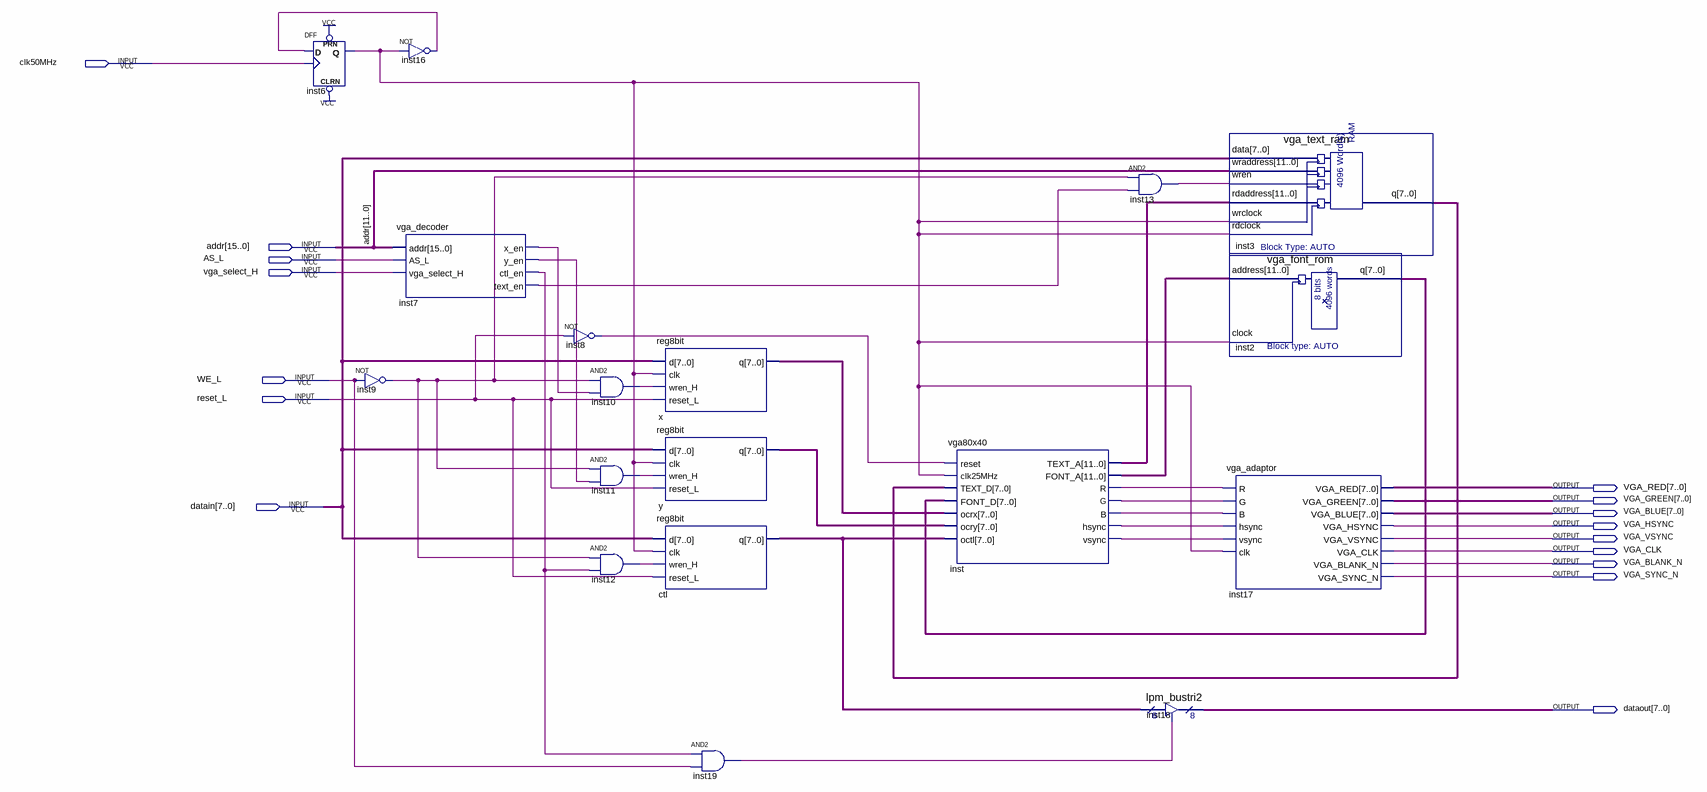
[diagram p0: schematic sheet]
// Quartus schematic vga.bdf as structural Verilog: 18 symbols, 16 pins
module vga (
  input  clk50MHz,
  input  [15:0] addr,
  input  AS_L,
  input  vga_select_H,
  input  WE_L,
  input  reset_L,
  input  [7:0] datain,
  output [7:0] VGA_RED,
  output [7:0] VGA_GREEN,
  output [7:0] VGA_BLUE,
  output VGA_HSYNC,
  output VGA_VSYNC,
  output VGA_CLK,
  output VGA_BLANK_N,
  output VGA_SYNC_N,
  output [7:0] dataout
);

  wire inst6_q, inst7_ctl_en, inst7_text_en, inst7_x_en, inst7_y_en, inst8_out, inst9_out, inst10_out,
       inst11_out, inst12_out, inst13_out, inst16_out, inst19_out, inst_b, inst_g, inst_hsync, inst_r,
       inst_vsync;
  wire [7:0] ctl_q, inst2_q, inst3_q, x_q, y_q;
  wire [11:0] inst_font_a, inst_text_a;

  DFF inst6 (.CLRN(1'b1), .CLK(clk50MHz), .D(inst16_out), .PRN(1'b1), .Q(inst6_q));
  not inst9 (inst9_out, WE_L);
  not inst16 (inst16_out, inst6_q);
  vga_decoder inst7 (
    .addr(addr), .AS_L(AS_L), .vga_select_H(vga_select_H), .x_en(inst7_x_en), .y_en(inst7_y_en),
    .ctl_en(inst7_ctl_en), .text_en(inst7_text_en));
  not inst8 (inst8_out, reset_L);
  and inst10 (inst10_out, inst9_out, inst7_x_en);
  and inst11 (inst11_out, inst9_out, inst7_y_en);
  and inst12 (inst12_out, inst9_out, inst7_ctl_en);
  reg8bit x (.d(datain), .clk(inst6_q), .wren_H(inst10_out), .reset_L(reset_L), .q(x_q));
  reg8bit y (.d(datain), .clk(inst6_q), .wren_H(inst11_out), .reset_L(reset_L), .q(y_q));
  reg8bit ctl (.d(datain), .clk(inst6_q), .wren_H(inst12_out), .reset_L(reset_L), .q(ctl_q));
  and inst19 (inst19_out, inst7_ctl_en, WE_L);
  vga80x40 inst (
    .reset(inst8_out), .clk25MHz(inst6_q), .TEXT_D(inst3_q), .FONT_D(inst2_q), .ocrx(x_q), .ocry(y_q),
    .octl(ctl_q), .TEXT_A(inst_text_a), .FONT_A(inst_font_a), .R(inst_r), .G(inst_g), .B(inst_b),
    .hsync(inst_hsync), .vsync(inst_vsync));
  and inst13 (inst13_out, inst9_out, inst7_text_en);
  lpm_bustri2 inst18 (.enabledt(inst19_out), .data(ctl_q), .tridata(dataout));
  vga_text_ram inst3 (
    .data(datain), .wraddress(addr[11:0]), .wren(inst13_out), .rdaddress(inst_text_a), .wrclock(inst6_q),
    .rdclock(inst6_q), .q(inst3_q));
  vga_font_rom inst2 (.address(inst_font_a), .clock(inst6_q), .q(inst2_q));
  vga_adaptor inst17 (
    .R(inst_r), .G(inst_g), .B(inst_b), .hsync(inst_hsync), .vsync(inst_vsync), .clk(inst6_q),
    .VGA_RED(VGA_RED), .VGA_GREEN(VGA_GREEN), .VGA_BLUE(VGA_BLUE), .VGA_HSYNC(VGA_HSYNC),
    .VGA_VSYNC(VGA_VSYNC), .VGA_CLK(VGA_CLK), .VGA_BLANK_N(VGA_BLANK_N), .VGA_SYNC_N(VGA_SYNC_N));
endmodule
